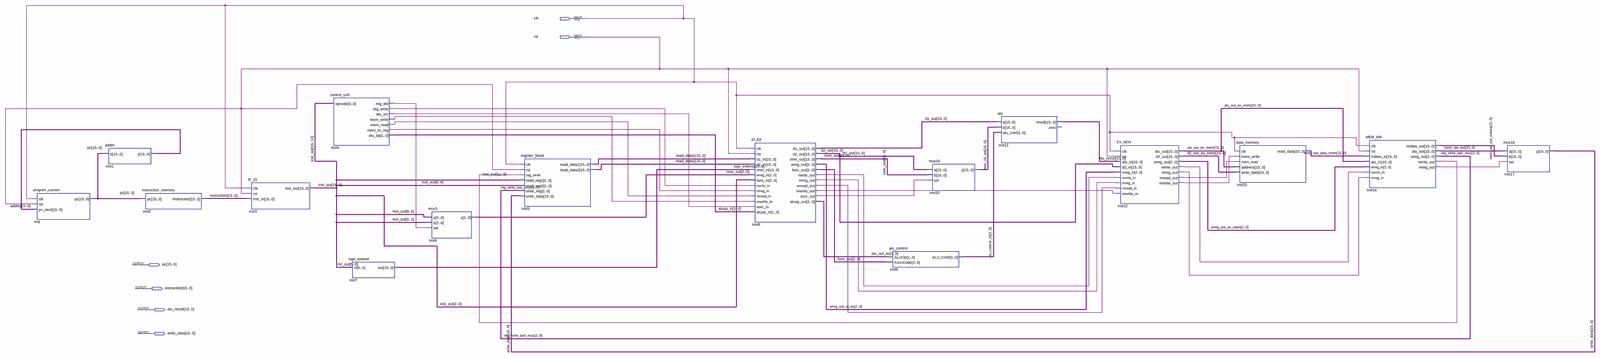
[diagram p0: schematic sheet, whole]
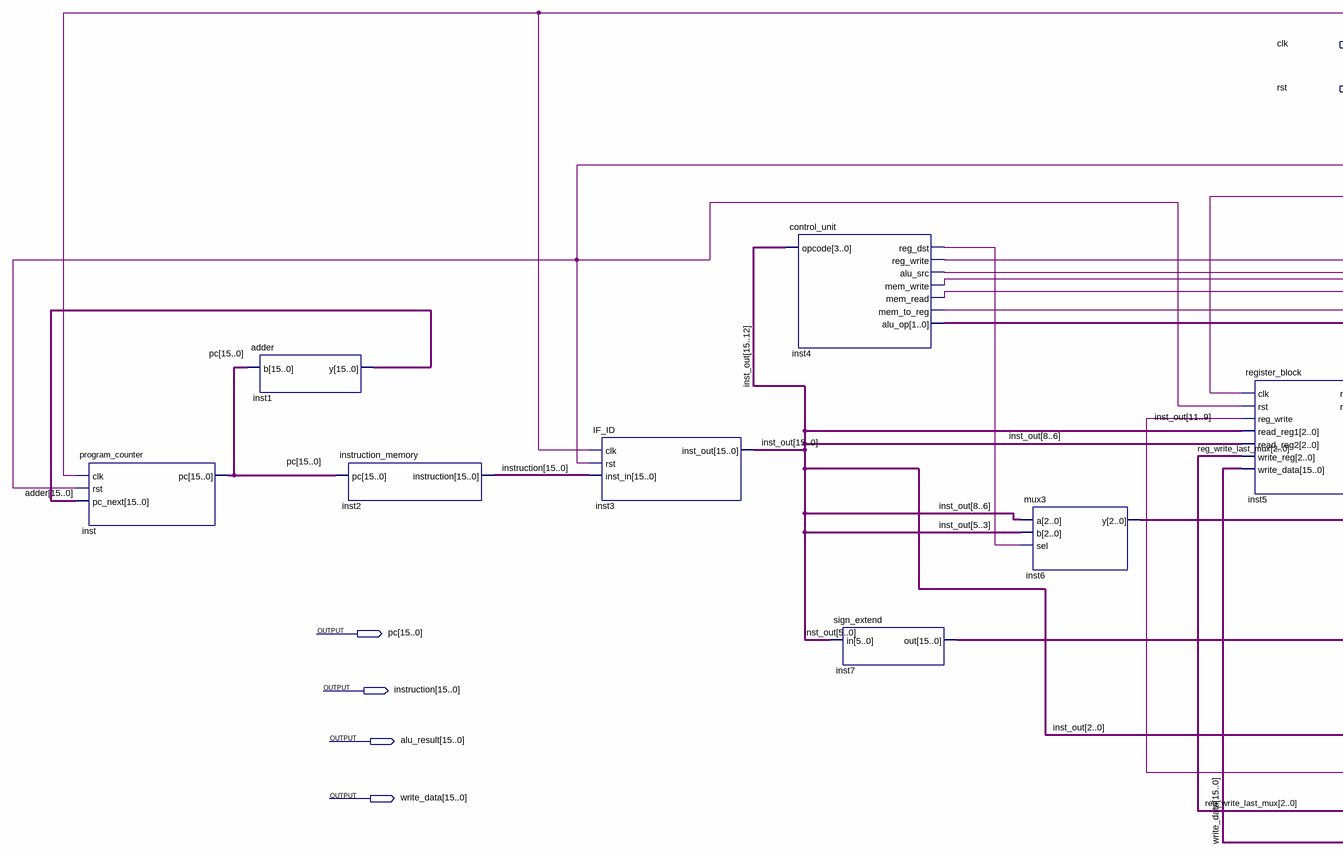
[diagram p1: schematic sheet, left part]
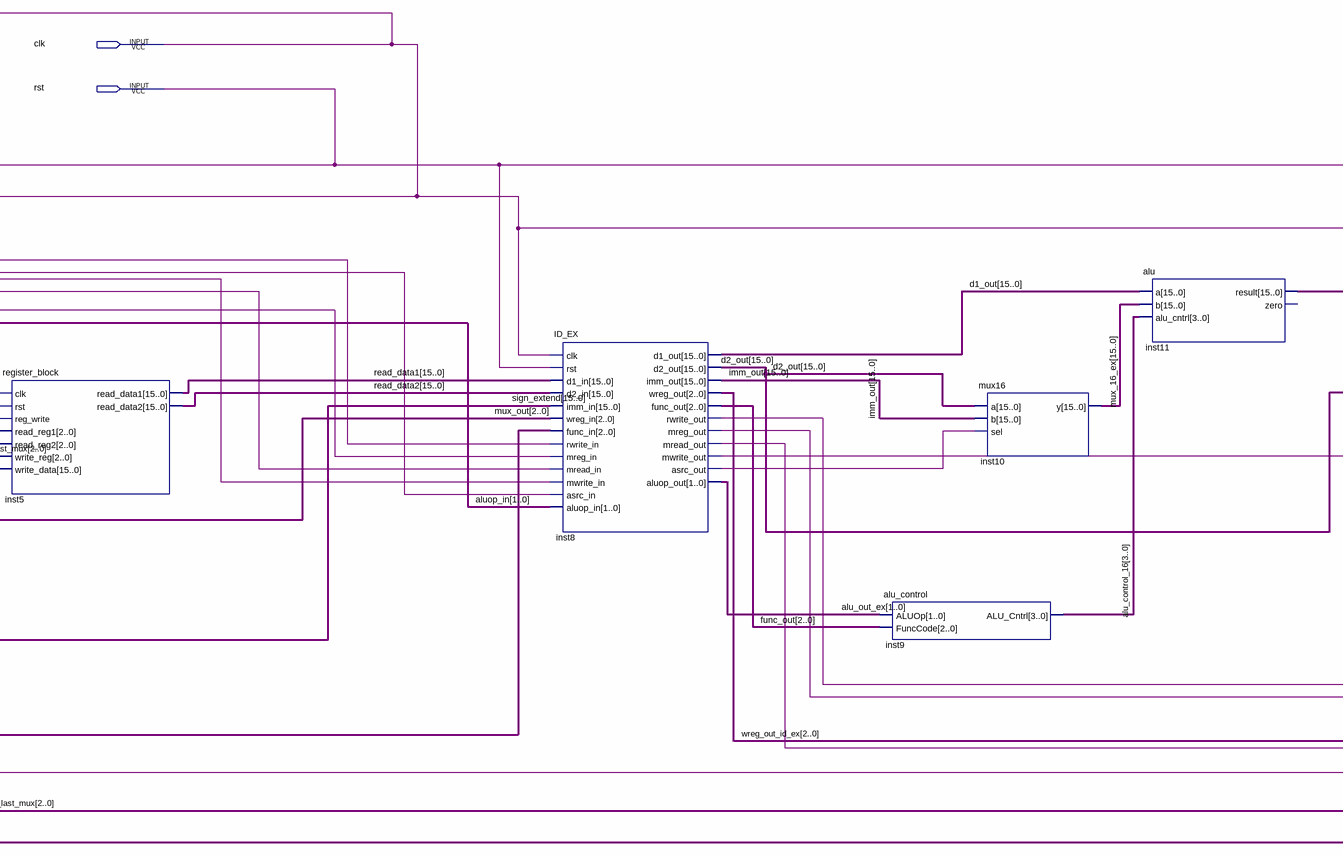
[diagram p2: schematic sheet, centre part]
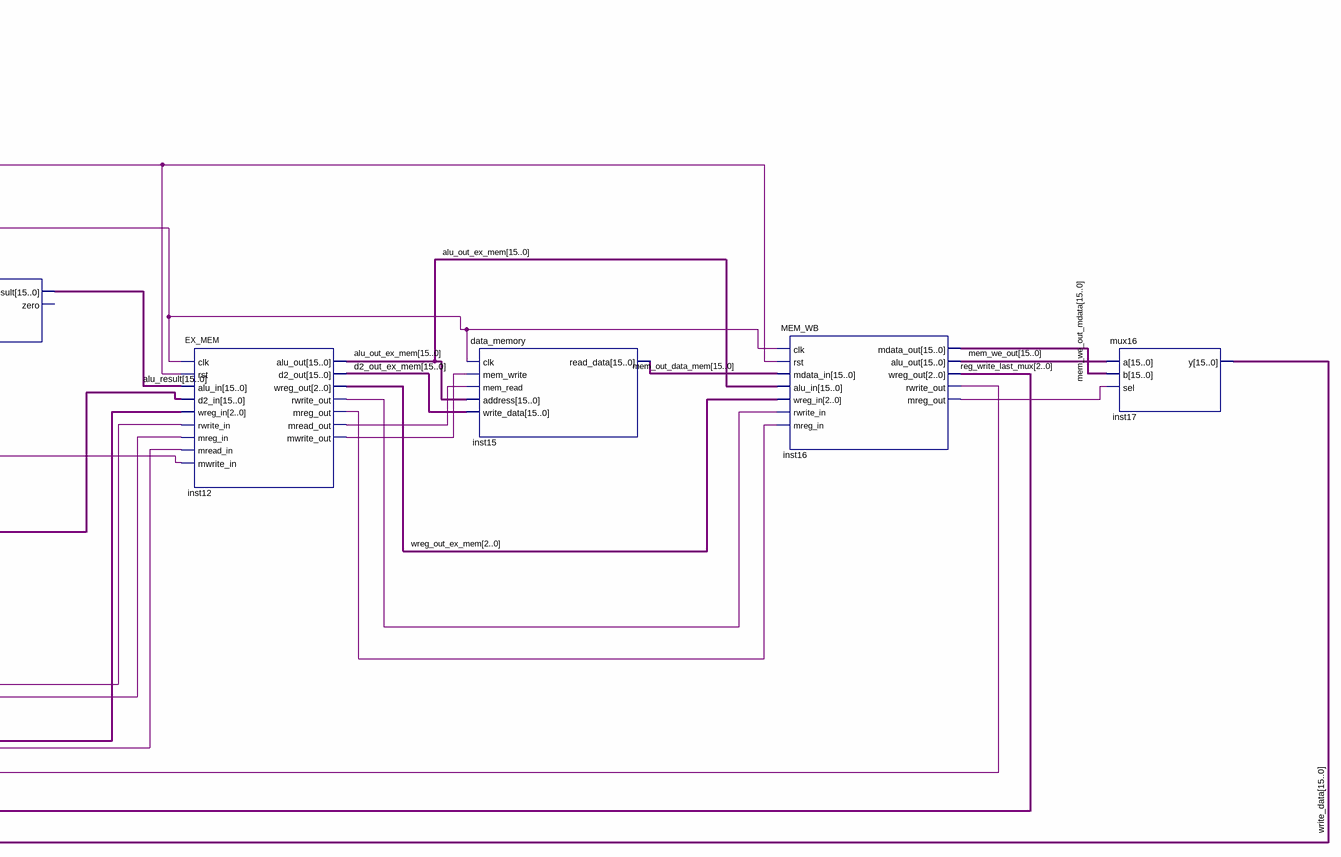
[diagram p3: schematic sheet, right part]
// Quartus schematic pipelineCycle.bdf as structural Verilog: 16 symbols, 6 pins
module pipelineCycle (
  input  clk,
  input  rst,
  output [15:0] pc,
  output [15:0] instruction,
  output [15:0] alu_result,
  output [15:0] write_data
);

  wire inst4_alu_src, inst4_mem_read, inst4_mem_to_reg, inst4_mem_write, inst4_reg_dst, inst4_reg_write,
       inst8_asrc_out, inst8_mread_out, inst8_mreg_out, inst8_mwrite_out, inst8_rwrite_out, inst12_mread_out,
       inst12_mreg_out, inst12_mwrite_out, inst12_rwrite_out, inst16_mreg_out, inst16_rwrite_out;
  wire [1:0] alu_out_ex, aluop_in;
  wire [2:0] func_out, mux_out, reg_write_last_mux, wreg_out_ex_mem, wreg_out_id_ex;
  wire [3:0] alu_control_16;
  wire [15:0] adder, alu_out_ex_mem, d1_out, d2_out, d2_out_ex_mem, imm_out, inst_out, mem_out_data_mem,
       mem_we_out, mem_we_out_mdata, mux_16_ex, read_data1, read_data2, sign_extend;

  program_counter inst (.clk(clk), .rst(rst), .pc_next(adder), .pc(pc));
  adder inst1 (.b(pc), .y(adder));
  instruction_memory inst2 (.pc(pc), .instruction(instruction));
  IF_ID inst3 (.clk(clk), .rst(rst), .inst_in(instruction), .inst_out(inst_out));
  control_unit inst4 (
    .opcode(inst_out[15:12]), .reg_dst(inst4_reg_dst), .reg_write(inst4_reg_write), .alu_src(inst4_alu_src),
    .mem_write(inst4_mem_write), .mem_read(inst4_mem_read), .mem_to_reg(inst4_mem_to_reg), .alu_op(aluop_in));
  sign_extend inst7 (.in(inst_out[5:0]), .out(sign_extend));
  mux3 inst6 (.a(inst_out[8:6]), .b(inst_out[5:3]), .sel(inst4_reg_dst), .y(mux_out));
  register_block inst5 (
    .clk(clk), .rst(rst), .reg_write(inst16_rwrite_out), .read_reg1(inst_out[11:9]),
    .read_reg2(inst_out[8:6]), .write_reg(reg_write_last_mux), .write_data(write_data),
    .read_data1(read_data1), .read_data2(read_data2));
  ID_EX inst8 (
    .clk(clk), .rst(rst), .d1_in(read_data1), .d2_in(read_data2), .imm_in(sign_extend), .wreg_in(mux_out),
    .func_in(inst_out[2:0]), .rwrite_in(inst4_reg_write), .mreg_in(inst4_mem_to_reg),
    .mread_in(inst4_mem_read), .mwrite_in(inst4_mem_write), .asrc_in(inst4_alu_src), .aluop_in(aluop_in),
    .d1_out(d1_out), .d2_out(d2_out), .imm_out(imm_out), .wreg_out(wreg_out_id_ex), .func_out(func_out),
    .rwrite_out(inst8_rwrite_out), .mreg_out(inst8_mreg_out), .mread_out(inst8_mread_out),
    .mwrite_out(inst8_mwrite_out), .asrc_out(inst8_asrc_out), .aluop_out(alu_out_ex));
  alu_control inst9 (.ALUOp(alu_out_ex), .FuncCode(func_out), .ALU_Cntrl(alu_control_16));
  mux16 inst10 (.a(d2_out), .b(imm_out), .sel(inst8_asrc_out), .y(mux_16_ex));
  alu inst11 (.a(d1_out), .b(mux_16_ex), .alu_cntrl(alu_control_16), .result(alu_result));  // open: zero
  EX_MEM inst12 (
    .clk(clk), .rst(rst), .alu_in(alu_result), .d2_in(d2_out), .wreg_in(wreg_out_id_ex),
    .rwrite_in(inst8_rwrite_out), .mreg_in(inst8_mreg_out), .mread_in(inst8_mread_out),
    .mwrite_in(inst8_mwrite_out), .alu_out(alu_out_ex_mem), .d2_out(d2_out_ex_mem),
    .wreg_out(wreg_out_ex_mem), .rwrite_out(inst12_rwrite_out), .mreg_out(inst12_mreg_out),
    .mread_out(inst12_mread_out), .mwrite_out(inst12_mwrite_out));
  data_memory inst15 (
    .clk(clk), .mem_write(inst12_mwrite_out), .mem_read(inst12_mread_out), .address(alu_out_ex_mem),
    .write_data(d2_out_ex_mem), .read_data(mem_out_data_mem));
  MEM_WB inst16 (
    .clk(clk), .rst(rst), .mdata_in(mem_out_data_mem), .alu_in(alu_out_ex_mem), .wreg_in(wreg_out_ex_mem),
    .rwrite_in(inst12_rwrite_out), .mreg_in(inst12_mreg_out), .mdata_out(mem_we_out_mdata),
    .alu_out(mem_we_out), .wreg_out(reg_write_last_mux), .rwrite_out(inst16_rwrite_out),
    .mreg_out(inst16_mreg_out));
  mux16 inst17 (.a(mem_we_out), .b(mem_we_out_mdata), .sel(inst16_mreg_out), .y(write_data));
endmodule
